# Altium schematic sheet SDC.SchDoc
size A0
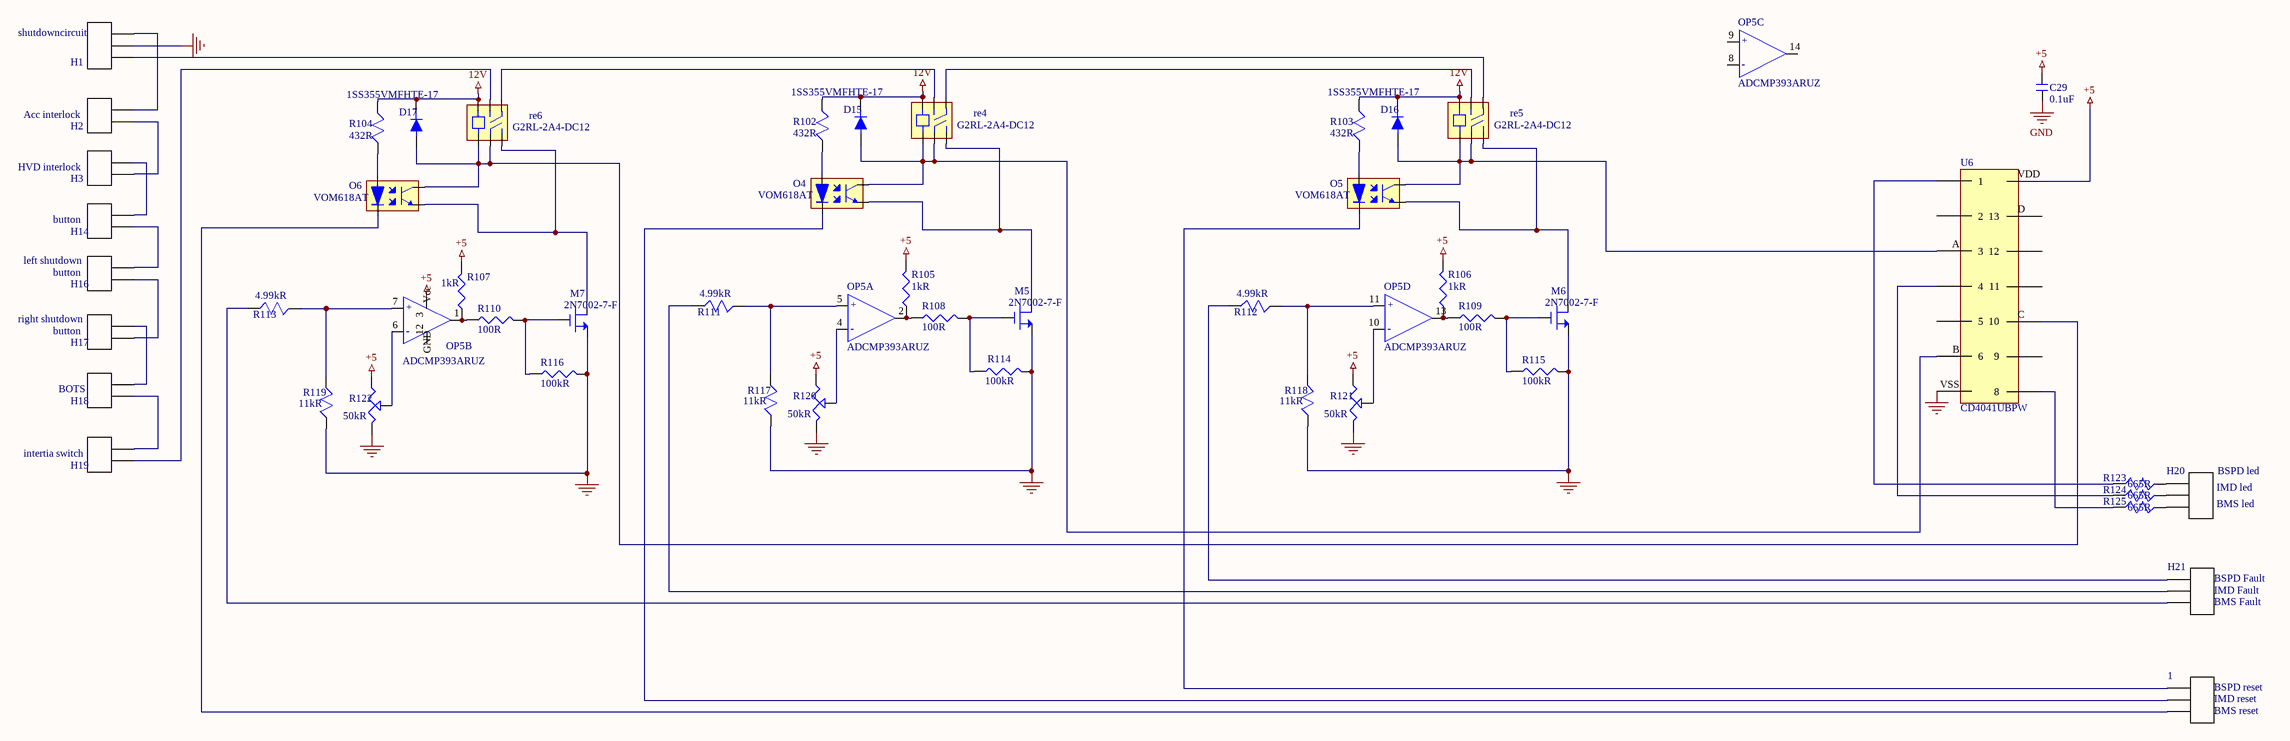
[diagram p0: SDC.SchDoc]

## Parts
1  B3B-PH-K-S(LF)(SN)  [*JST_B3B-PH-K-S(LF)(SN)]  (value not drawn)
C29  0.1uF  [0603-0.1uF-Capacitor]
D15  1SS355VMFHTE-17  [1SS355VMFHTE-17]
D16  1SS355VMFHTE-17  [1SS355VMFHTE-17]
D17  1SS355VMFHTE-17  [1SS355VMFHTE-17]
H1  B3B-PH-K-S(LF)(SN)  [*JST_B3B-PH-K-S(LF)(SN)]  (value not drawn)
H2  B2B-PH-K-S(LF)(SN)  [*JST_B2B-PH-K-S(LF)(SN)]  (value not drawn)
H3  B2B-PH-K-S(LF)(SN)  [*JST_B2B-PH-K-S(LF)(SN)]  (value not drawn)
H14  B2B-PH-K-S(LF)(SN)  [*JST_B2B-PH-K-S(LF)(SN)]  (value not drawn)
H16  B2B-PH-K-S(LF)(SN)  [*JST_B2B-PH-K-S(LF)(SN)]  (value not drawn)
H17  B2B-PH-K-S(LF)(SN)  [*JST_B2B-PH-K-S(LF)(SN)]  (value not drawn)
H18  B2B-PH-K-S(LF)(SN)  [*JST_B2B-PH-K-S(LF)(SN)]  (value not drawn)
H19  B2B-PH-K-S(LF)(SN)  [*JST_B2B-PH-K-S(LF)(SN)]  (value not drawn)
H20  B3B-PH-K-S(LF)(SN)  [*JST_B3B-PH-K-S(LF)(SN)]  (value not drawn)
H21  B3B-PH-K-S(LF)(SN)  [*JST_B3B-PH-K-S(LF)(SN)]  (value not drawn)
M5  2N7002-7-F  [2N7002-7-F]
M6  2N7002-7-F  [2N7002-7-F]
M7  2N7002-7-F  [2N7002-7-F]
O4  VOM618AT  [VOM618AT]
O5  VOM618AT  [VOM618AT]
O6  VOM618AT  [VOM618AT]
OP5  ADCMP393ARUZ  (parts A,B,C,D of 4)
R102  432R  [432R]
R103  432R  [432R]
R104  432R  [432R]
R105  1kR  [0805-Resistor]
R106  1kR  [0805-Resistor]
R107  1kR  [0805-Resistor]
R108  100R  [0805-Resistor]
R109  100R  [0805-Resistor]
R110  100R  [0805-Resistor]
R111  4.99kR  [4.99kR]
R112  4.99kR  [4.99kR]
R113  4.99kR  [4.99kR]
R114  100kR  [0805-Resistor]
R115  100kR  [0805-Resistor]
R116  100kR  [0805-Resistor]
R117  11kR  [Yageo 0805]
R118  11kR  [Yageo 0805]
R119  11kR  [Yageo 0805]
R120  50kR  [50kR-vertical]
R121  50kR  [50kR-vertical]
R122  50kR  [50kR-vertical]
R123  665R  [665R,499R]
R124  665R  [665R,499R]
R125  665R  [665R,499R]
re4  G2RL-2A4-DC12  [G2RL-2A4-DC12]
re5  G2RL-2A4-DC12  [G2RL-2A4-DC12]
re6  G2RL-2A4-DC12  [G2RL-2A4-DC12]
U6  CD4041UBPW

## Nets
12V: D15.1 D16.1 D17.1 R102.2 R103.2 R104.2 re4.8 re5.8 re6.8
+5: C29.2 OP5.3(Vcc) R105.2 R106.2 R107.2 R120.1 R121.1 R122.1 U6.VDD
GND: C29.1 H1.2 M5.2 M6.2 M7.2 R114.2 R115.2 R116.2 R117.1 R118.1 R119.1 R120.3 R121.3 R122.3 U6.VSS
Net1_1: 1.1 O5.2
Net1_2: 1.2 O4.2
Net1_3: 1.3 O6.2
NetD15_2: D15.2 O4.4 re4.1 re4.3 U6.B(6)
NetD16_2: D16.2 O5.4 re5.1 re5.3 U6.A(3)
NetD17_2: D17.2 O6.4 re6.1 re6.3 U6.C(10)
NetH1_1: H1.1 re5.5
NetH1_3: H1.3 H2.2
NetH2_1: H2.1 H3.1
NetH3_2: H3.2 H14.2
NetH14_1: H14.1 H16.2
NetH16_1: H16.1 H17.1
NetH17_2: H17.2 H18.2
NetH18_1: H18.1 H19.2
NetH19_1: H19.1 re6.6
NetH20_1: H20.1 R123.1
NetH20_2: H20.2 R124.1
NetH20_3: H20.3 R125.1
NetH21_1: H21.1 R112.1
NetH21_2: H21.2 R111.1
NetH21_3: H21.3 R113.1
NetM5_1: M5.1 R108.2 R114.1
NetM5_3: M5.3 O4.3 re4.4
NetM6_1: M6.1 R109.2 R115.1
NetM6_3: M6.3 O5.3 re5.4
NetM7_1: M7.1 R110.2 R116.1
NetM7_3: M7.3 O6.3 re6.4
NetO4_1: O4.1 R102.1
NetO5_1: O5.1 R103.1
NetO6_1: O6.1 R104.1
NetOP5_1: OP5.1(out) R107.1 R110.1
NetOP5_2: OP5.2(out) R105.1 R108.1
NetOP5_4: OP5.4(-) R120.2
NetOP5_5: OP5.5(+) R111.2 R117.2
NetOP5_6: OP5.6(-) R122.2
NetOP5_7: OP5.7(+) R113.2 R119.2
NetOP5_10: OP5.10(-) R121.2
NetOP5_11: OP5.11(+) R112.2 R118.2
NetOP5_13: OP5.13(out) R106.1 R109.1
NetR123_2: R123.2 U6.1
NetR124_2: R124.2 U6.4
NetR125_2: R125.2 U6.8
Netre4_5: re4.5 re5.6
Netre4_6: re4.6 re6.5

Not connected (* = marked no-connect by the designer): OP5 8(-) 9(+) 12(GND) 14(out); U6 2 5 9 11 12 D(13)

## Notes on the sheet
- (near H1) shutdowncircuit
- (near H2) Acc interlock
- (near H3) HVD interlock
- (near H14) button
- (near H16) left shutdown
- (near H16) button
- (near H17) right shutdown
- (near H17) button
- (near H18) BOTS
- (near H19) intertia switch
- (near H20) IMD led
- (near H20) BSPD led
- (near H20) BMS led
- (near H21) BSPD Fault
- (near H21) BMS Fault
- (near H21) IMD Fault
- (near 1) BSPD reset
- (near 1) IMD reset
- (near 1) BMS reset

## Library data of the parts
1 H1 H20 H21 = B3B-PH-K-S(LF)(SN)_1: Connector Header Through Hole 3 position 0.079 _2.00mm_; MP: B3B-PH-K-S_LF__SN_; MF: JST Sales; SnapEDA_Link: https://www.snapeda.com/parts/B4B-PH-K-S%28LF%29%28SN%29/JST%20Sales%20America%20Inc./view-part/422410/?ref=snap; Package: None; Price: None; Availability: Unavailable; Value: *
C29 = 0.1uF-C0603X104K5RAC3316: Cap Ceramic 0.1uF 50V X7R 10% Pad SMD 0603 Flexible Termination 125C Automotive; Manufacturer: KEMET; Supplier 1: Mouser; Supplier Part Number 1: 80-C0603X104K5R3316; Manufacturer Part Number: C0603X104K5RAC3316; Stock 1: 9731; Pricing 1: 1 = 0.19000, 10 = 0.12700, 100 = 0.06400, 500 = 0.04400, 1000 = 0.03800, 4000 = 0.03700 (USD); ComponentLink1URL: http://datasheet.octopart.com/C0603X104K5RAC3316-KEMET-datasheet-136663908.pdf?src-supplier=Allied+Electronics; ComponentLink1Description: http://datasheet.octopart.com/C0603X104K5RAC3316-KEMET-datasheet-136663908.pdf?src-supplier=Allied+Electronics
D15-D17 = 1SS355VMFHTE-17: ROHM         1SS355VMFHTE-17             Small Signal Diode, Single, 90 V, 100 mA, 1.2 V, 4 ns, 500 mA; Max Repetitive Reverse Voltage (Vrrm): 90V; Forward Current: 100mA; Forward Voltage: 1.2V; Reverse Recovery Time: 4ns; Max Forward Surge Current (Ifsm): 500mA; Supplier 1: Mouser; Supplier Part Number 1: 755-1SS355VMFHTE-17; Manufacturer: Rohm; Manufacturer Part Number: 1SS355VMFHTE-17; RoHS: No; Stock 1: 46949; Pricing 1: 1 = 0.31000, 10 = 0.21200, 100 = 0.08900, 1000 = 0.06000, 3000 = 0.04700, 9000 = 0.04700 (USD); Case/Package: SOD; Number of Pins: 2; Max Operating Temperature: 150°C; Packaging: Cut Tape; Element Configuration: Single; REACH SVHC: Unknown; ComponentLink1URL: http://www.farnell.com/datasheets/2296360.pdf?src-supplier=Farnell; ComponentLink1Description: http://www.farnell.com/datasheets/2296360.pdf?src-supplier=Farnell; ComponentLink2URL: http://www.farnell.com/datasheets/2021474.pdf?src-supplier=Farnell; ComponentLink2Description: http://www.farnell.com/datasheets/2021474.pdf?src-supplier=Farnell; ComponentLink3URL: https://www.rohm.com/datasheet/1SS355VMFH/1ss355vmfhte-17-e?src-supplier=Digi-Key; ComponentLink3Description: https://www.rohm.com/datasheet/1SS355VMFH/1ss355vmfhte-17-e?src-supplier=Digi-Key; ComponentLink4URL: http://www.farnell.com/datasheets/2296360.pdf?src-supplier=Newark; ComponentLink4Description: http://www.farnell.com/datasheets/2296360.pdf?src-supplier=Newark; ComponentLink5URL: http://www.farnell.com/datasheets/2021474.pdf?src-supplier=Element14; ComponentLink5Description: http://www.farnell.com/datasheets/2021474.pdf?src-supplier=Element14; catagory: diode
H2 H3 H14 H16-H19 = B2B-PH-K-S(LF)(SN): Connector Header Through Hole 2 position 0.079 _2.00mm_; MF: JST Sales; MP: B2B-PH-K-S_LF__SN_; Availability: Unavailable; Package: None; Price: None; SnapEDA_Link: https://www.snapeda.com/parts/B2B-PH-K-S%28LF%29%28SN%29/JST%20Sales%20America%20Inc./view-part/424103/?ref=snap; Value: *
M5-M7 = 2N7002-7-F: Manufacturer: Diodes Inc.; Nominal Vgs: 2.5V; Max Power Dissipation: 300mW; Drain to Source Voltage (Vdss): 60V; Continuous Drain Current (ID): 115mA; Rise Time: 3ns; Rds On Max: 7.5R; Input Capacitance: 50pF; Number of Elements: 1; Drain to Source Breakdown Voltage: 70V; Gate to Source Voltage (Vgs): 20V; Fall Time: 5.6ns; Turn-Off Delay Time: 11ns; Turn-On Delay Time: 7ns; Power Dissipation: 540mW; Element Configuration: Single; Current: 115A; catagory: nmos; Supplier 1: Mouser; Supplier Part Number 1: 621-2N7002-F; Manufacturer Part Number: 2N7002-7-F; Stock 1: 2405582; Pricing 1: 1 = 0.10000, 10 = 0.03800, 100 = 0.02700, 1000 = 0.02700, 3000 = 0.02700, 9000 = 0.02500, 24000 = 0.02300, 45000 = 0.02000, 99000 = 0.01900 (USD); Mount: Surface Mount; Case/Package: SOT-23; Number of Pins: 3; Weight: 0.000282oz; Contact Plating: Tin; Min Operating Temperature: -55°C; Max Operating Temperature: 150°C; Packaging: Tape and Reel; Package Quantity: 3000; Dual Supply Voltage: 60V; Number of Channels: 1; Drain to Source Resistance: 7.5R; On-State Resistance: 7.5R; Threshold Voltage: 2.5V; Termination: SMD/SMT; Voltage Rating (DC): 60V; Current Rating: 115mA; Voltage: 60V; Length: 2.9mm; Height: 1mm; Width: 1.3mm; Radiation Hardening: No; REACH SVHC: No SVHC; Lead Free: Lead Free; ComponentLink1URL: https://datasheet.ciiva.com/3304/ds11303-3304385.pdf?src-supplier=Avnet; ComponentLink1Description: https://datasheet.ciiva.com/3304/ds11303-3304385.pdf?src-supplier=Avnet; ComponentLink2URL: https://datasheet.ciiva.com/15219/getdatasheetpartid-110059-15219667.pdf?src-supplier=Verical; ComponentLink2Description: https://datasheet.ciiva.com/15219/getdatasheetpartid-110059-15219667.pdf?src-supplier=Verical; ComponentLink3URL: https://datasheet.ciiva.com/49020/70437206-49020102.pdf?src-supplier=Allied+Electronics; ComponentLink3Description: https://datasheet.ciiva.com/49020/70437206-49020102.pdf?src-supplier=Allied+Electronics; ComponentLink4URL: https://datasheet.ciiva.com/22712/1915452-22712375.pdf?src-supplier=Element14; ComponentLink4Description: https://datasheet.ciiva.com/22712/1915452-22712375.pdf?src-supplier=Element14; ComponentLink5URL: https://datasheet.ciiva.com/1188/ds11303-1188363.pdf?src-supplier=Element14; ComponentLink5Description: https://datasheet.ciiva.com/1188/ds11303-1188363.pdf?src-supplier=Element14
O4-O6 = VOM618AT: VOM618AT DC Input Phototransistor Output Optocoupler, Surface Mount, 4-Pin SOP; Manufacturer: Vishay; Reverse Breakdown Voltage: 6V; Forward Voltage: 1.6V; Forward Current: 60mA; Max Power Dissipation: 170mW; Number of Channels: 1; Collector Emitter Voltage (VCEO): 80V; Rise Time: 6us; Collector Emitter Saturation Voltage: 400mV; Max Collector Current: 100mA; Fall Time: 29us; Isolation Voltage: 3.75kV; Current Transfer Ratio: 600%; catagory: optotransister; Supplier 1: Mouser; Supplier Part Number 1: 78-VOM618AT; Manufacturer Part Number: VOM618AT; Stock 1: 3046; Pricing 1: 1 = 0.78000, 10 = 0.58000, 100 = 0.40100, 500 = 0.32500, 1000 = 0.26000, 3000 = 0.26000 (USD); Mount: Surface Mount; Case/Package: SOP; Number of Pins: 4; Min Operating Temperature: -55°C; Max Operating Temperature: 110°C; Packaging: Tape and Reel; Package Quantity: 3000; Reverse Voltage (DC): 6V; Output Voltage: 80V; Output Current per Channel: 100mA; Max Input Current: 60mA; Number of Elements: 1; Power Dissipation: 170mW; Max Output Voltage: 80V; Input Current: 60mA; Collector Emitter Breakdown Voltage: 80V; Length: 4.4mm; Height: 2mm; Width: 3.85mm; Radiation Hardening: No; Lead Free: Lead Free; ComponentLink1URL: https://datasheet.ciiva.com/14809/vom618a-14809332.pdf?src-supplier=Arrow; ComponentLink1Description: https://datasheet.ciiva.com/14809/vom618a-14809332.pdf?src-supplier=Arrow; ComponentLink2URL: https://datasheet.ciiva.com/26941/getdatasheetpartid-641279-26941966.pdf?src-supplier=Verical; ComponentLink2Description: https://datasheet.ciiva.com/26941/getdatasheetpartid-641279-26941966.pdf?src-supplier=Verical; ComponentLink3URL: https://datasheet.ciiva.com/26121/vom618a-26121477.pdf?src-supplier=Avnet+Europe; ComponentLink3Description: https://datasheet.ciiva.com/26121/vom618a-26121477.pdf?src-supplier=Avnet+Europe; ComponentLink4URL: https://datasheet.ciiva.com/16388/vom618a-16388008.pdf?src-supplier=Future+Electronics; ComponentLink4Description: https://datasheet.ciiva.com/16388/vom618a-16388008.pdf?src-supplier=Future+Electronics; ComponentLink5URL: https://datasheet.ciiva.com/14079/vom618a-14079934.pdf?src-supplier=Digi-Key; ComponentLink5Description: https://datasheet.ciiva.com/14079/vom618a-14079934.pdf?src-supplier=Digi-Key; ComponentLink6URL: http://datasheet.octopart.com/VOM618AT-Vishay-datasheet-13041718.pdf?src-supplier=Future+Electronics; ComponentLink6Description: http://datasheet.octopart.com/VOM618AT-Vishay-datasheet-13041718.pdf?src-supplier=Future+Electronics; ComponentLink7URL: http://datasheet.octopart.com/VOM618AT-Vishay-datasheet-12559985.pdf?src-supplier=Future+Electronics; ComponentLink7Description: http://datasheet.octopart.com/VOM618AT-Vishay-datasheet-12559985.pdf?src-supplier=Future+Electronics; ComponentLink8URL: http://datasheet.octopart.com/VOM618AT-Vishay-Siliconix-datasheet-62309874.pdf?src-supplier=Allied+Electronics; ComponentLink8Description: http://datasheet.octopart.com/VOM618AT-Vishay-Siliconix-datasheet-62309874.pdf?src-supplier=Allied+Electronics
OP5 = ADCMP393ARUZ: Comparator Quad R-R I/P 5.5V 14-Pin TSSOP Tube; Manufacturer: Analog Devices; Voltage Gain: 132dB; Min Supply Voltage: 2.3V; Number of Elements: 4; Input Offset Voltage (Vos): 500uV; Input Bias Current: 30nA; Quiescent Current: 36.8uA; Propagation Delay: 4.2us; Hysteresis: 4mV; Common Mode Rejection Ratio: 74dB; Power Supply Rejection Ratio (PSRR): 80dB; Supplier 1: Mouser; Supplier Part Number 1: 584-ADCMP393ARUZ; Manufacturer Part Number: ADCMP393ARUZ; Stock 1: 1354; Pricing 1: 1 = 1.50000, 10 = 1.35000, 50 = 1.27000, 100 = 1.02000, 1000 = 0.68800, 10000 = 0.65200 (USD); Mount: Surface Mount; Case/Package: TSSOP; Number of Pins: 14; Contact Plating: Tin; Min Operating Temperature: -40°C; Max Operating Temperature: 125°C; Packaging: Rail/Tube; Max Supply Voltage: 5.5V; Type: General Purpose; Operating Supply Current: 36.8uA; Lead Free: Contains Lead; RoHS Compliant: Yes; ComponentLink1URL: https://datasheet.ciiva.com/48678/adcmp393-48678181.pdf?src-supplier=Avnet; ComponentLink1Description: https://datasheet.ciiva.com/48678/adcmp393-48678181.pdf?src-supplier=Avnet; ComponentLink2URL: http://datasheet.octopart.com/ADCMP393ARUZ-Analog-Devices-datasheet-27207877.pdf?src-supplier=Analog+Devices; ComponentLink2Description: http://datasheet.octopart.com/ADCMP393ARUZ-Analog-Devices-datasheet-27207877.pdf?src-supplier=Analog+Devices; ComponentLink3URL: http://datasheet.octopart.com/ADCMP393ARUZ-Analog-Devices-datasheet-38899545.pdf?src-supplier=Analog+Devices; ComponentLink3Description: http://datasheet.octopart.com/ADCMP393ARUZ-Analog-Devices-datasheet-38899545.pdf?src-supplier=Analog+Devices; ComponentLink4URL: http://datasheet.octopart.com/ADCMP393ARUZ-Analog-Devices-datasheet-62311843.pdf?src-supplier=Farnell; ComponentLink4Description: http://datasheet.octopart.com/ADCMP393ARUZ-Analog-Devices-datasheet-62311843.pdf?src-supplier=Farnell; ComponentLink5URL: http://datasheet.octopart.com/ADCMP393ARUZ-Analog-Devices-datasheet-78864183.pdf?src-supplier=Farnell; ComponentLink5Description: http://datasheet.octopart.com/ADCMP393ARUZ-Analog-Devices-datasheet-78864183.pdf?src-supplier=Farnell; ComponentLink6URL: http://datasheet.octopart.com/ADCMP393ARUZ-Analog-Devices-datasheet-140566748.pdf?src-supplier=Arrow.cn; ComponentLink6Description: http://datasheet.octopart.com/ADCMP393ARUZ-Analog-Devices-datasheet-140566748.pdf?src-supplier=Arrow.cn
R102-R104 = RT0805FRE07432RL: Res Thin Film 0805 432 Ohm 1% 1/8W ±50ppm/°C Molded SMD SMD Paper T/R; Manufacturer: Yageo; Power Rating: 125mW; Voltage Rating: 150V; catagory: resister; Supplier 1: Mouser; Supplier Part Number 1: 603-RT0805FRE07432RL; Manufacturer Part Number: RT0805FRE07432RL; Stock 1: 2636; Pricing 1: 1 = 0.12000, 10 = 0.06400, 100 = 0.02300, 1000 = 0.01600, 5000 = 0.01100, 10000 = 0.01000 (USD); Case/Package: 0805; Case Code (Metric): 2012; Case Code (Imperial): 0805; Contact Plating: Tin; Min Operating Temperature: -55°C; Max Operating Temperature: 125°C; Resistance: 432R; Tolerance: 1%; Packaging: Tape and Reel; Composition: Thin Film; Termination: SMD/SMT; Temperature Coefficient: 50ppm/°C; Voltage Rating (DC): 150V; Length: 2mm; Height: 500um; Width: 1.25mm; Radiation Hardening: No; Lead Free: Lead Free; ComponentLink1URL: https://datasheet.ciiva.com/12703/pyu-rt-1-to-0-05-rohs-l-4-12703656.pdf?src-supplier=Mouser; ComponentLink1Description: https://datasheet.ciiva.com/12703/pyu-rt-1-to-0-05-rohs-l-4-12703656.pdf?src-supplier=Mouser; ComponentLink2URL: http://datasheet.octopart.com/RT0805FRE07432RL-Yageo-datasheet-86813807.pdf; ComponentLink2Description: http://datasheet.octopart.com/RT0805FRE07432RL-Yageo-datasheet-86813807.pdf
R105-R110 = 100k-CRCW0805100KFKEAC: Res Thick Film 0805 100K Ohm 1% 1/8W ±100ppm/°C Molded SMD Paper T/R; Manufacturer: Vishay; Power Rating: 125mW; Resistance: 100kR; Supplier 1: Mouser; Supplier Part Number 1: 71-CRCW0805100KFKEAC; Manufacturer Part Number: CRCW0805100KFKEAC; Stock 1: 206602; Pricing 1: 1 = 0.10000, 10 = 0.05900, 100 = 0.02400, 1000 = 0.01000, 5000 = 0.00700, 10000 = 0.00600, 25000 = 0.00500 (USD); Mount: Surface Mount; Case/Package: Molded; Contact Plating: Tin; Min Operating Temperature: -55°C; Max Operating Temperature: 155°C; Composition: Thick Film; Termination: Wraparound; Temperature Coefficient: 100ppm/°C; Tolerance: 1%; Length: 2mm; Lead Free: Lead Free; ComponentLink1URL: http://www.vishay.com/docs/20035/dcrcwe3.pdf?src-supplier=Avnet+Asia; ComponentLink1Description: http://www.vishay.com/docs/20035/dcrcwe3.pdf?src-supplier=Avnet+Asia; ComponentLink2URL: http://www.vishay.com/docs/28773/crcwce3.pdf?src-supplier=Digi-Key; ComponentLink2Description: http://www.vishay.com/docs/28773/crcwce3.pdf?src-supplier=Digi-Key; ComponentLink3URL: http://datasheet.octopart.com/CRCW0805100KFKEAC-Vishay-datasheet-100063072.pdf?src-supplier=Future+Electronics; ComponentLink3Description: http://datasheet.octopart.com/CRCW0805100KFKEAC-Vishay-datasheet-100063072.pdf?src-supplier=Future+Electronics
R111-R113 = RT0805DRE074K99L: Res Thin Film 0805 4.99K Ohm 0.5% 1/8W ±50ppm/°C Molded SMD Paper T/R; Manufacturer: Yageo; Max Power Dissipation: 125mW; Voltage Rating (DC): 150V; catagory: resister; Supplier 1: Mouser; Supplier Part Number 1: 603-RT0805DRE074K99L; Manufacturer Part Number: RT0805DRE074K99L; Stock 1: 12154; Pricing 1: 1 = 0.17000, 10 = 0.08800, 100 = 0.03100, 1000 = 0.02200, 5000 = 0.01500, 10000 = 0.01400 (USD); Case/Package: 0805; Case Code (Metric): 2012; Case Code (Imperial): 0805; Min Operating Temperature: -55°C; Max Operating Temperature: 155°C; Resistance: 4.99kR; Tolerance: 0.5%; Packaging: Tape and Reel; Package Quantity: 5000; Composition: Thin Film; Number of Terminations: 2; Military Standard: Not; Temperature Coefficient: 50ppm/°C; Features: Moisture Resistant; Length: 0.079inch; Height: 0.024inch; Width: 0.049inch; Depth: 1.25mm; Lead Free: Lead Free; ComponentLink1URL: https://datasheet.ciiva.com/2569/pyu-rt-1-to-0-05-rohs-l-5-2569530.pdf?src-supplier=Digi-Key; ComponentLink1Description: https://datasheet.ciiva.com/2569/pyu-rt-1-to-0-05-rohs-l-5-2569530.pdf?src-supplier=Digi-Key; ComponentLink2URL: http://datasheet.octopart.com/RT0805DRE074K99L-Yageo-datasheet-86813807.pdf; ComponentLink2Description: http://datasheet.octopart.com/RT0805DRE074K99L-Yageo-datasheet-86813807.pdf
R114-R116 = 100k-CRCW0805100KFKEAC: Res Thick Film 0805 100K Ohm 1% 1/8W ±100ppm/°C Molded SMD Paper T/R; Manufacturer: Vishay; Power Rating: 125mW; Supplier 1: Mouser; Supplier Part Number 1: 71-CRCW0805100KFKEAC; Manufacturer Part Number: CRCW0805100KFKEAC; Stock 1: 206602; Pricing 1: 1 = 0.10000, 10 = 0.05900, 100 = 0.02400, 1000 = 0.01000, 5000 = 0.00700, 10000 = 0.00600, 25000 = 0.00500 (USD); Mount: Surface Mount; Case/Package: Molded; Contact Plating: Tin; Min Operating Temperature: -55°C; Max Operating Temperature: 155°C; Composition: Thick Film; Termination: Wraparound; Temperature Coefficient: 100ppm/°C; Resistance: 100kR; Tolerance: 1%; Length: 2mm; Lead Free: Lead Free; ComponentLink1URL: http://www.vishay.com/docs/20035/dcrcwe3.pdf?src-supplier=Avnet+Asia; ComponentLink1Description: http://www.vishay.com/docs/20035/dcrcwe3.pdf?src-supplier=Avnet+Asia; ComponentLink2URL: http://www.vishay.com/docs/28773/crcwce3.pdf?src-supplier=Digi-Key; ComponentLink2Description: http://www.vishay.com/docs/28773/crcwce3.pdf?src-supplier=Digi-Key; ComponentLink3URL: http://datasheet.octopart.com/CRCW0805100KFKEAC-Vishay-datasheet-100063072.pdf?src-supplier=Future+Electronics; ComponentLink3Description: http://datasheet.octopart.com/CRCW0805100KFKEAC-Vishay-datasheet-100063072.pdf?src-supplier=Future+Electronics
R117-R119 = RT0805DRE0711KL: Res High Precision Thin Film 0805 11k Ohm 0.5% 1/8W ±50ppm/°C Molded Paper T/R; Manufacturer: Yageo; Max Power Dissipation: 125mW; Voltage Rating (DC): 150V; catagory: resister; Supplier 1: Mouser; Supplier Part Number 1: 603-RT0805DRE0711KL; Manufacturer Part Number: RT0805DRE0711KL; Stock 1: 6290; Pricing 1: 1 = 0.17000, 10 = 0.08800, 100 = 0.03100, 1000 = 0.02200, 5000 = 0.01500, 10000 = 0.01400 (USD); Case/Package: 0805; Case Code (Metric): 2012; Case Code (Imperial): 0805; Min Operating Temperature: -55°C; Max Operating Temperature: 155°C; Package Quantity: 5000; Packaging: Tape and Reel; Resistance: 11kR; Tolerance: 0.5%; Composition: Thin Film; Number of Terminations: 2; Temperature Coefficient: 50ppm/°C; Features: Moisture Resistant; Length: 0.079inch; Height: 0.024inch; Width: 0.049inch; Lead Free: Lead Free; ComponentLink1URL: https://datasheet.ciiva.com/2569/pyu-rt-1-to-0-05-rohs-l-5-2569184.pdf?src-supplier=Digi-Key; ComponentLink1Description: https://datasheet.ciiva.com/2569/pyu-rt-1-to-0-05-rohs-l-5-2569184.pdf?src-supplier=Digi-Key; ComponentLink2URL: http://datasheet.octopart.com/RT0805DRE0711KL-Yageo-datasheet-86813807.pdf; ComponentLink2Description: http://datasheet.octopart.com/RT0805DRE0711KL-Yageo-datasheet-86813807.pdf
R120-R122 = 50K可變垂直-3296W-1-503LF: Trimmer; Cermet; Rest 50 Kilohms; PCB; Pwr-Rtg 0.5W; Dim 0.375InLx0.19InWx0.395InH; Manufacturer: Bourns; Tolerance: 10%; Power Rating: 500mW; Number of Turns: 25; Insulation Resistance: 1GR; Temperature Coefficient: 100ppm/°C; Supplier 1: Mouser; Manufacturer Part Number: 3296W-1-503LF; Stock 1: 3535; Pricing 1: 1 = 2.31000, 10 = 1.83000, 50 = 1.76000, 100 = 1.62000, 500 = 1.34000, 1000 = 1.27000, 2000 = 1.09000, 5000 = 1.06000, 10000 = 0.94700 (USD); Mount: Panel; Weight: 0.03oz; Number of Terminals: 3; Color: Blue; Contact Plating: Tin; Min Operating Temperature: -55°C; Max Operating Temperature: 125°C; Resistance: 50kR; Packaging: Rail/Tube; Package Quantity: 50; Composition: Cermet; Termination: Pin; Taper: Linear; Military Standard: Not; Max Power Dissipation: 500mW; Type: Potentiometer; Length: 9.53mm; Height: 0.395inch; Width: 9.53mm; Depth: 4.83mm; Radiation Hardening: No; REACH SVHC: No SVHC; Lead Free: Lead Free; ComponentLink1URL: https://datasheet.ciiva.com/6178/172577-6178371.pdf?src-supplier=Distrelec; ComponentLink1Description: https://datasheet.ciiva.com/6178/172577-6178371.pdf?src-supplier=Distrelec; ComponentLink2URL: https://datasheet.ciiva.com/27747/769485-27747554.pdf?src-supplier=Jameco; ComponentLink2Description: https://datasheet.ciiva.com/27747/769485-27747554.pdf?src-supplier=Jameco; ComponentLink3URL: https://datasheet.ciiva.com/11831/0900766b8069ccf4-11831072.pdf?src-supplier=RSComponents; ComponentLink3Description: https://datasheet.ciiva.com/11831/0900766b8069ccf4-11831072.pdf?src-supplier=RSComponents; ComponentLink4URL: https://datasheet.ciiva.com/29122/447285-da-01-en-trimmer-tht3296w-1-503lf-50k-0-5w-29122369.pdf?src-supplier=Conrad; ComponentLink4Description: https://datasheet.ciiva.com/29122/447285-da-01-en-trimmer-tht3296w-1-503lf-50k-0-5w-29122369.pdf?src-supplier=Conrad; ComponentLink5URL: https://datasheet.ciiva.com/3266/3296-3266197.pdf?src-supplier=Avnet; ComponentLink5Description: https://datasheet.ciiva.com/3266/3296-3266197.pdf?src-supplier=Avnet; ComponentLink6URL: https://datasheet.ciiva.com/2156/3296-2156902.pdf?src-supplier=Digi-Key; ComponentLink6Description: https://datasheet.ciiva.com/2156/3296-2156902.pdf?src-supplier=Digi-Key; ComponentLink7URL: https://datasheet.ciiva.com/25907/3296-25907261.pdf?src-supplier=Avnet+Europe; ComponentLink7Description: https://datasheet.ciiva.com/25907/3296-25907261.pdf?src-supplier=Avnet+Europe; ComponentLink8URL: https://datasheet.ciiva.com/1131/1815117-1131346.pdf?src-supplier=Element14; ComponentLink8Description: https://datasheet.ciiva.com/1131/1815117-1131346.pdf?src-supplier=Element14; ComponentLink9URL: https://datasheet.ciiva.com/20164/68-0300e-20164056.pdf?src-supplier=Rapid+Electronics; ComponentLink9Description: https://datasheet.ciiva.com/20164/68-0300e-20164056.pdf?src-supplier=Rapid+Electronics; ComponentLink10URL: https://datasheet.ciiva.com/30233/3296-30233887.pdf?src-supplier=Onlinecomponents.com; ComponentLink10Description: https://datasheet.ciiva.com/30233/3296-30233887.pdf?src-supplier=Onlinecomponents.com; ComponentLink11URL: http://datasheet.octopart.com/3296W-1-503LF-Bourns-datasheet-9257.pdf?src-supplier=Factory+Futures; ComponentLink11Description: http://datasheet.octopart.com/3296W-1-503LF-Bourns-datasheet-9257.pdf?src-supplier=Factory+Futures; ComponentLink12URL: http://datasheet.octopart.com/3296W-1-503LF-Bourns-datasheet-8754025.pdf?src-supplier=Electro+Sonic; ComponentLink12Description: http://datasheet.octopart.com/3296W-1-503LF-Bourns-datasheet-8754025.pdf?src-supplier=Electro+Sonic; ComponentLink13URL: http://datasheet.octopart.com/3296W-1-503LF-Bourns-datasheet-62345832.pdf?src-supplier=Element14; ComponentLink13Description: http://datasheet.octopart.com/3296W-1-503LF-Bourns-datasheet-62345832.pdf?src-supplier=Element14; ComponentLink14URL: http://datasheet.octopart.com/3296W-1-503LF-Bourns-datasheet-8458046.pdf?src-supplier=Factory+Futures; ComponentLink14Description: http://datasheet.octopart.com/3296W-1-503LF-Bourns-datasheet-8458046.pdf?src-supplier=Factory+Futures; ComponentLink15URL: http://datasheet.octopart.com/3296W-1-503LF-Bourns-datasheet-8359740.pdf?src-supplier=_legacy+Avnet; ComponentLink15Description: http://datasheet.octopart.com/3296W-1-503LF-Bourns-datasheet-8359740.pdf?src-supplier=_legacy+Avnet; ComponentLink16URL: http://datasheet.octopart.com/3296W-1-503LF-Bourns-datasheet-25360155.pdf?src-supplier=Allied+Electronics; ComponentLink16Description: http://datasheet.octopart.com/3296W-1-503LF-Bourns-datasheet-25360155.pdf?src-supplier=Allied+Electronics; ComponentLink17URL: http://datasheet.octopart.com/3296W-1-503LF-Bourns-datasheet-47378.pdf?src-supplier=Allied+Electronics; ComponentLink17Description: http://datasheet.octopart.com/3296W-1-503LF-Bourns-datasheet-47378.pdf?src-supplier=Allied+Electronics; ComponentLink18URL: http://datasheet.octopart.com/3296W-1-503LF-Bourns-datasheet-528316.pdf?src-supplier=Farnell; ComponentLink18Description: http://datasheet.octopart.com/3296W-1-503LF-Bourns-datasheet-528316.pdf?src-supplier=Farnell; ComponentLink19URL: http://datasheet.octopart.com/3296W-1-503LF-Bourns-datasheet-6152.pdf?src-supplier=Farnell; ComponentLink19Description: http://datasheet.octopart.com/3296W-1-503LF-Bourns-datasheet-6152.pdf?src-supplier=Farnell; ComponentLink20URL: http://datasheet.octopart.com/3296W-1-503LF.-Bourns-datasheet-7284159.pdf?src-supplier=Jameco; ComponentLink20Description: http://datasheet.octopart.com/3296W-1-503LF.-Bourns-datasheet-7284159.pdf?src-supplier=Jameco; ComponentLink21URL: http://datasheet.octopart.com/3296W-1-503LF-Bourns-datasheet-14175298.pdf?src-supplier=IIIC; ComponentLink21Description: http://datasheet.octopart.com/3296W-1-503LF-Bourns-datasheet-14175298.pdf?src-supplier=IIIC; ComponentLink22URL: http://datasheet.octopart.com/3296W-1-503LF-Bourns-datasheet-17840116.pdf?src-supplier=Jameco; ComponentLink22Description: http://datasheet.octopart.com/3296W-1-503LF-Bourns-datasheet-17840116.pdf?src-supplier=Jameco; Supplier Part Number 1: 652-3296W-1-503LF
R123-R125 = RP73PF2A665RBTDF: Res Thin Film 0805 665 Ohm 0.1% 1/8W ±25ppm/°C Molded SMD Paper T/R; Manufacturer: TE Connectivity; Power Rating: 250mW; Voltage Rating: 150V; catagory: resister; Supplier 1: Mouser; Supplier Part Number 1: 279-RP73PF2A665RBTDF; Manufacturer Part Number: RP73PF2A665RBTDF; Stock 1: 1934; Pricing 1: 1 = 0.36000, 10 = 0.33400, 100 = 0.25600, 500 = 0.22300, 1000 = 0.18400, 2000 = 0.16800 (USD); Case/Package: 0805; Case Code (Metric): 2012; Case Code (Imperial): 0805; Min Operating Temperature: -55°C; Max Operating Temperature: 155°C; Resistance: 665R; Tolerance: 0.1%; Packaging: Cut Tape; Composition: Thin Film; Termination: Flat; Temperature Coefficient: 25ppm/°C; Voltage Rating (DC): 150V; Length: 2mm; Height: 0.55mm; Depth: 1.25mm; REACH SVHC: No SVHC; ComponentLink1URL: https://datasheet.ciiva.com/46393/1635325-46393238.pdf?src-supplier=Element14; ComponentLink1Description: https://datasheet.ciiva.com/46393/1635325-46393238.pdf?src-supplier=Element14; ComponentLink2URL: https://datasheet.ciiva.com/7863/1635325-7863032.pdf?src-supplier=Element14; ComponentLink2Description: https://datasheet.ciiva.com/7863/1635325-7863032.pdf?src-supplier=Element14; ComponentLink3URL: http://datasheet.octopart.com/2176092-2-TE-Connectivity-datasheet-97102182.pdf?src-supplier=TE+Connectivity; ComponentLink3Description: http://datasheet.octopart.com/2176092-2-TE-Connectivity-datasheet-97102182.pdf?src-supplier=TE+Connectivity; ComponentLink4URL: http://datasheet.octopart.com/RP73PF2A665RBTDF-TE-Connectivity-datasheet-11516962.pdf?src-supplier=Element14; ComponentLink4Description: http://datasheet.octopart.com/RP73PF2A665RBTDF-TE-Connectivity-datasheet-11516962.pdf?src-supplier=Element14; ComponentLink5URL: http://datasheet.octopart.com/RP73PF2A665RBTDF-Tyco-Electronics-datasheet-11120217.pdf?src-supplier=Farnell; ComponentLink5Description: http://datasheet.octopart.com/RP73PF2A665RBTDF-Tyco-Electronics-datasheet-11120217.pdf?src-supplier=Farnell
re4-re6 = G2RL-2A4-DC12: Power Relay 12VDC 8A DPST-NO( (29mm 12.7mm 15.7mm)) THT; Manufacturer: Omron; Max Voltage Rating (AC): 440V; Max Voltage Rating (DC): 300V; Throw Configuration: DPST; Coil Resistance: 360R; Coil Current: 33.3mA; Coil Voltage (DC): 12V; Power Consumption: 400mW; Operate Time: 15ms; Coil Type: Non-Latching; Relay Type: General Purpose; Release Time: 5ms; Supplier 1: Mouser; Supplier Part Number 1: 653-G2RL-2A4-DC12; Manufacturer Part Number: G2RL-2A4-DC12; Stock 1: 117; Pricing 1: 1 = 4.17000, 25 = 3.46000, 50 = 3.30000, 100 = 3.13000, 200 = 2.82000, 500 = 2.82000 (USD); Mount: Through Hole; Case/Package: DIP; Number of Pins: 6; Weight: 12g; Contact Material: Silver; Min Operating Temperature: -40°C; Max Operating Temperature: 85°C; Packaging: Bulk; Max Current Rating: 8A; Package Quantity: 20; Contact Current Rating: 8A; Termination: PC Pin; Coil Power: 400mW; Length: 29mm; Height: 15.7mm; Width: 12.7mm; Radiation Hardening: No; ComponentLink1URL: https://datasheet.ciiva.com/43511/en-g2rl-43511039.pdf?src-supplier=Onlinecomponents.com; ComponentLink1Description: https://datasheet.ciiva.com/43511/en-g2rl-43511039.pdf?src-supplier=Onlinecomponents.com; ComponentLink2URL: https://datasheet.ciiva.com/5236/g2rl-0911-5236343.pdf?src-supplier=Mouser; ComponentLink2Description: https://datasheet.ciiva.com/5236/g2rl-0911-5236343.pdf?src-supplier=Mouser; ComponentLink3URL: https://datasheet.ciiva.com/8687/g2rl-0911-8687997.pdf?src-supplier=Avnet; ComponentLink3Description: https://datasheet.ciiva.com/8687/g2rl-0911-8687997.pdf?src-supplier=Avnet; ComponentLink4URL: http://datasheet.octopart.com/G2RL-2A4-DC12-Omron-datasheet-10910117.pdf?src-supplier=Electro+Sonic; ComponentLink4Description: http://datasheet.octopart.com/G2RL-2A4-DC12-Omron-datasheet-10910117.pdf?src-supplier=Electro+Sonic; ComponentLink5URL: http://datasheet.octopart.com/G2RL-2A4-DC12-Omron-datasheet-16972895.pdf?src-supplier=Sager+Electronics; ComponentLink5Description: http://datasheet.octopart.com/G2RL-2A4-DC12-Omron-datasheet-16972895.pdf?src-supplier=Sager+Electronics; catagory: relay
U6 = CD4041UBPW: Buffer 4-CH Inverting/Non-Inverting Push-Pull CMOS 14-Pin TSSOP Tube; Manufacturer: Texas Instruments; Max Supply Voltage: 18V; Min Supply Voltage: 3V; Propagation Delay: 50ns; Number of Elements: 4; Low Level Output Current: 24mA; Number of Output Lines: 8; Number of Bits per Element: 1; High Level Output Current: -24mA; Quiescent Current: 20uA; Turn-On Delay Time: 120ns; Max Power Dissipation: 100mW; Supplier 1: Digi-Key; Supplier Part Number 1: CD4041UBPW-ND; Manufacturer Part Number: CD4041UBPW; Stock 1: 700; Pricing 1: 1 = 1.29000, 10 = 1.15600, 25 = 1.09760, 100 = 0.90160, 250 = 0.84280, 500 = 0.74480, 1000 = 0.58800, 2500 = 0.54880, 5000 = 0.52136 (USD); Mount: Surface Mount; Case/Package: TSSOP; Number of Pins: 14; Contact Plating: Gold; Min Operating Temperature: -55°C; Max Operating Temperature: 125°C; Packaging: Rail/Tube; Logic Function: Buffer; Package Quantity: 90; Number of Channels: 4; Number of Inputs: 4; Number of Outputs: 4; Number of Input Lines: 4; Polarity: Non-Inverting; Number of Bits: 4; Termination: SMD/SMT; Lead Free: Lead Free; REACH SVHC: No SVHC; ComponentLink1URL: https://datasheet.ciiva.com/1506/1762971-1506275.pdf?src-supplier=Element14; ComponentLink1Description: https://datasheet.ciiva.com/1506/1762971-1506275.pdf?src-supplier=Element14; ComponentLink2URL: https://datasheet.ciiva.com/46618/1836516-46618790.pdf?src-supplier=Newark; ComponentLink2Description: https://datasheet.ciiva.com/46618/1836516-46618790.pdf?src-supplier=Newark; ComponentLink3URL: https://datasheet.ciiva.com/1842/cd4041ub-1842824.pdf?src-supplier=Digi-Key; ComponentLink3Description: https://datasheet.ciiva.com/1842/cd4041ub-1842824.pdf?src-supplier=Digi-Key; ComponentLink4URL: https://octopart.com/click/track?ai=10049&ct=datasheets&sig=04d6427&at=physicalpart&sid=370&ppid=7097409&hlid=29930956&src-supplier=TI+store; ComponentLink4Description: https://octopart.com/click/track?ai=10049&ct=datasheets&sig=04d6427&at=physicalpart&sid=370&ppid=7097409&hlid=29930956&src-supplier=TI+store; ComponentLink5URL: http://datasheet.octopart.com/CD4041UBPW-Texas-Instruments-datasheet-10255163.pdf?src-supplier=Arrow+Electronics; ComponentLink5Description: http://datasheet.octopart.com/CD4041UBPW-Texas-Instruments-datasheet-10255163.pdf?src-supplier=Arrow+Electronics; ComponentLink6URL: http://datasheet.octopart.com/CD4041UBPW-Texas-Instruments-datasheet-27908145.pdf?src-supplier=TI+store; ComponentLink6Description: http://datasheet.octopart.com/CD4041UBPW-Texas-Instruments-datasheet-27908145.pdf?src-supplier=TI+store; ComponentLink7URL: http://datasheet.octopart.com/CD4041UBPW-Texas-Instruments-datasheet-149741.pdf?src-supplier=TI+store; ComponentLink7Description: http://datasheet.octopart.com/CD4041UBPW-Texas-Instruments-datasheet-149741.pdf?src-supplier=TI+store; ComponentLink8URL: http://datasheet.octopart.com/CD4041UBPW-Texas-Instruments-datasheet-10253518.pdf?src-supplier=TI+store; ComponentLink8Description: http://datasheet.octopart.com/CD4041UBPW-Texas-Instruments-datasheet-10253518.pdf?src-supplier=TI+store; ComponentLink9URL: http://sigma.octopart.com/49249819/technical_drawing/Texas-Instruments-CD4041UBPW.pdf?src-supplier=TI+store; ComponentLink9Description: http://sigma.octopart.com/49249819/technical_drawing/Texas-Instruments-CD4041UBPW.pdf?src-supplier=TI+store; ComponentLink10URL: http://datasheet.octopart.com/CD4041UBPW-Texas-Instruments-datasheet-8377696.pdf?src-supplier=Newark; ComponentLink10Description: http://datasheet.octopart.com/CD4041UBPW-Texas-Instruments-datasheet-8377696.pdf?src-supplier=Newark; ComponentLink11URL: http://datasheet.octopart.com/CD4041UBPW-Texas-Instruments-datasheet-654559.pdf?src-supplier=Newark; ComponentLink11Description: http://datasheet.octopart.com/CD4041UBPW-Texas-Instruments-datasheet-654559.pdf?src-supplier=Newark; ComponentLink12URL: http://datasheet.octopart.com/CD4041UBPW-Texas-Instruments-datasheet-8816533.pdf?src-supplier=Newark; ComponentLink12Description: http://datasheet.octopart.com/CD4041UBPW-Texas-Instruments-datasheet-8816533.pdf?src-supplier=Newark; ComponentLink13URL: http://datasheet.octopart.com/CD4041UBPW-Texas-Instruments-datasheet-11538150.pdf?src-supplier=Element14; ComponentLink13Description: http://datasheet.octopart.com/CD4041UBPW-Texas-Instruments-datasheet-11538150.pdf?src-supplier=Element14; ComponentLink14URL: http://datasheet.octopart.com/CD4041UBPW-Texas-Instruments-datasheet-21076600.pdf?src-supplier=Element14; ComponentLink14Description: http://datasheet.octopart.com/CD4041UBPW-Texas-Instruments-datasheet-21076600.pdf?src-supplier=Element14; ComponentLink15URL: http://datasheet.octopart.com/CD4041UBPW-Texas-Instruments-datasheet-47642687.pdf?src-supplier=Newark; ComponentLink15Description: http://datasheet.octopart.com/CD4041UBPW-Texas-Instruments-datasheet-47642687.pdf?src-supplier=Newark; ComponentLink16URL: http://datasheet.octopart.com/CD4041UBPW-Texas-Instruments-datasheet-102487265.pdf?src-supplier=Newark; ComponentLink16Description: http://datasheet.octopart.com/CD4041UBPW-Texas-Instruments-datasheet-102487265.pdf?src-supplier=Newark; Category: buffer